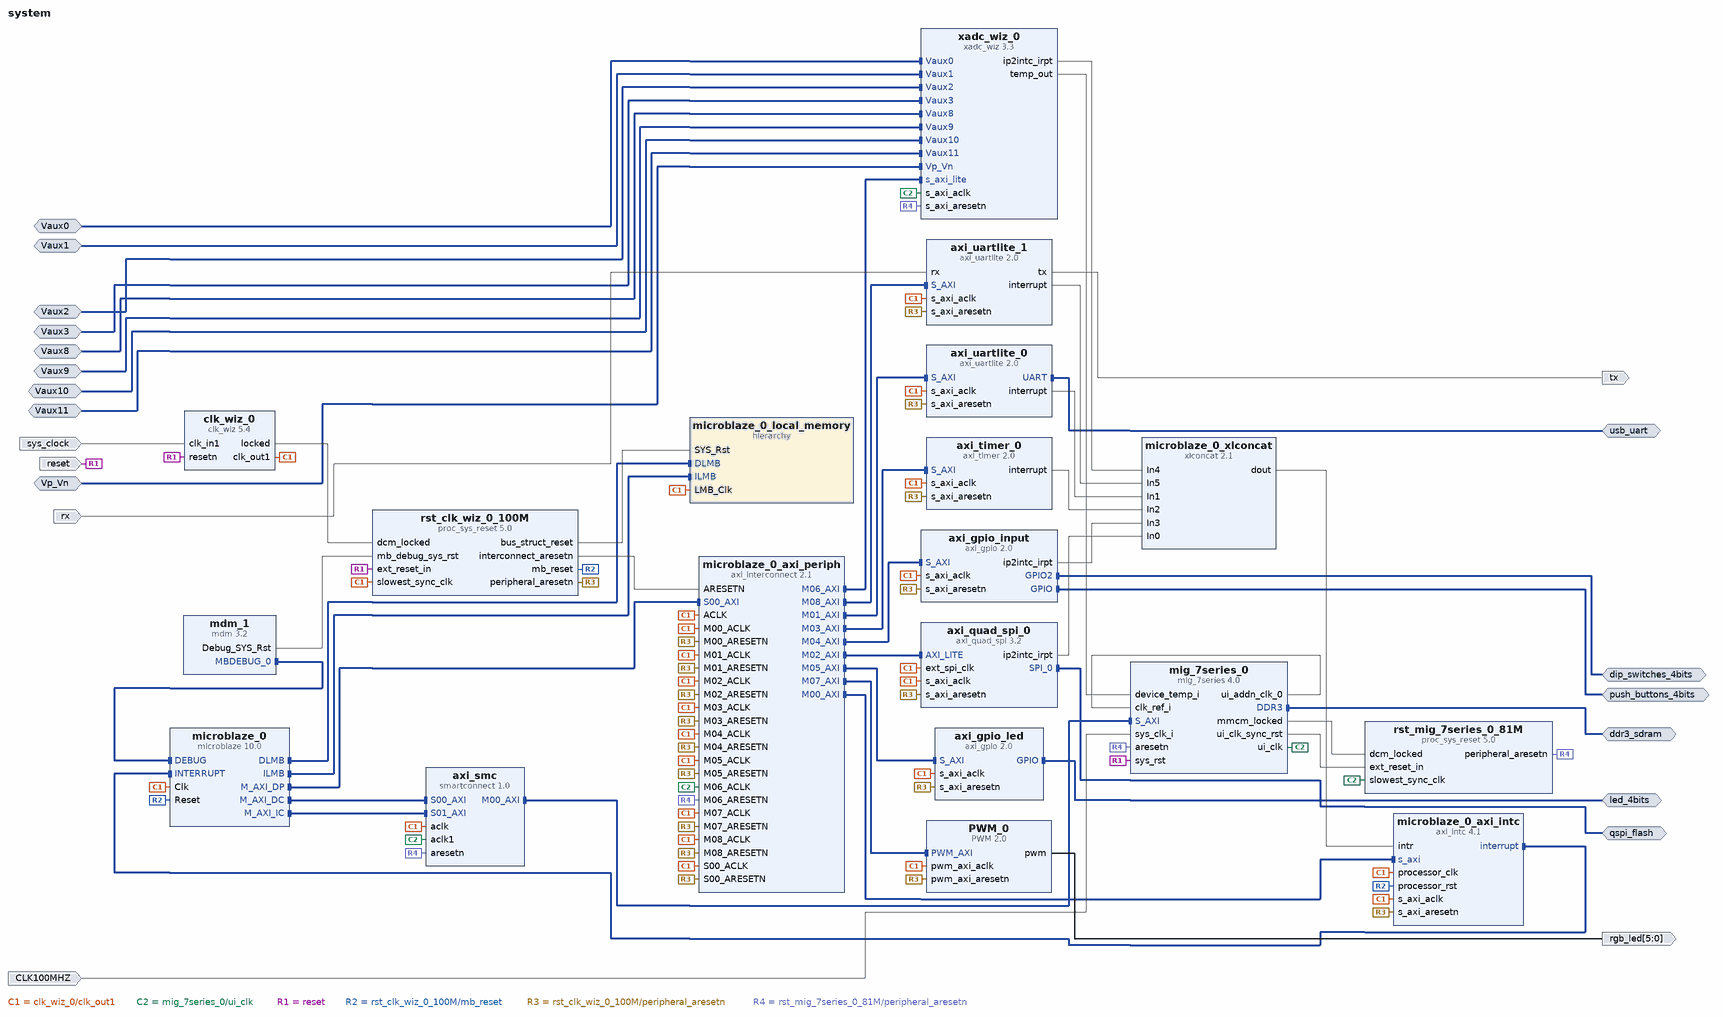
[diagram p0: block diagram of the top level]
# Vivado block design system, xc7s50csga324-1, Vivado 2017.4
create_bd_design system

create_bd_intf_port -mode Slave -vlnv xilinx.com:interface:diff_analog_io_rtl:1.0 Vaux0
create_bd_intf_port -mode Slave -vlnv xilinx.com:interface:diff_analog_io_rtl:1.0 Vaux1
create_bd_intf_port -mode Slave -vlnv xilinx.com:interface:diff_analog_io_rtl:1.0 Vaux2
create_bd_intf_port -mode Slave -vlnv xilinx.com:interface:diff_analog_io_rtl:1.0 Vaux3
create_bd_intf_port -mode Slave -vlnv xilinx.com:interface:diff_analog_io_rtl:1.0 Vaux8
create_bd_intf_port -mode Slave -vlnv xilinx.com:interface:diff_analog_io_rtl:1.0 Vaux9
create_bd_intf_port -mode Slave -vlnv xilinx.com:interface:diff_analog_io_rtl:1.0 Vaux10
create_bd_intf_port -mode Slave -vlnv xilinx.com:interface:diff_analog_io_rtl:1.0 Vaux11
create_bd_intf_port -mode Slave -vlnv xilinx.com:interface:diff_analog_io_rtl:1.0 Vp_Vn
create_bd_intf_port -mode Master -vlnv xilinx.com:interface:ddrx_rtl:1.0 ddr3_sdram
create_bd_intf_port -mode Master -vlnv xilinx.com:interface:gpio_rtl:1.0 dip_switches_4bits
create_bd_intf_port -mode Master -vlnv xilinx.com:interface:gpio_rtl:1.0 led_4bits
create_bd_intf_port -mode Master -vlnv xilinx.com:interface:gpio_rtl:1.0 push_buttons_4bits
create_bd_intf_port -mode Master -vlnv xilinx.com:interface:spi_rtl:1.0 qspi_flash
create_bd_intf_port -mode Master -vlnv xilinx.com:interface:uart_rtl:1.0 usb_uart
create_bd_port -dir O -from 5 -to 0 rgb_led
create_bd_port -dir I -type rst reset
set_property -dict {CONFIG.POLARITY ACTIVE_LOW} [get_bd_ports reset]
create_bd_port -dir I -type clk CLK100MHZ
create_bd_port -dir I -type clk sys_clock
set_property -dict {CONFIG.FREQ_HZ 12000000 CONFIG.PHASE 0.000} [get_bd_ports sys_clock]
create_bd_port -dir I rx
create_bd_port -dir O tx

create_bd_cell -type ip -vlnv digilentinc.com:IP:PWM:2.0 PWM_0
set_property -dict {CONFIG.NUM_PWM 6} [get_bd_cells PWM_0]
create_bd_cell -type hier microblaze_0_local_memory
create_bd_cell -type ip -vlnv xilinx.com:ip:axi_intc:4.1 microblaze_0_axi_intc
set_property -dict {CONFIG.C_HAS_FAST 1} [get_bd_cells microblaze_0_axi_intc]
create_bd_cell -type ip -vlnv xilinx.com:ip:xlconcat:2.1 microblaze_0_xlconcat
set_property -dict {CONFIG.NUM_PORTS 6 CONFIG.dout_width 6} [get_bd_cells microblaze_0_xlconcat]
create_bd_cell -type ip -vlnv xilinx.com:ip:mig_7series:4.0 mig_7series_0
set_property -dict {CONFIG.XML_INPUT_FILE board.prj CONFIG.BOARD_MIG_PARAM ddr3_sdram} [get_bd_cells mig_7series_0]
create_bd_cell -type ip -vlnv xilinx.com:ip:proc_sys_reset:5.0 rst_clk_wiz_0_100M
set_property -dict [list \
  CONFIG.C_EXT_RESET_HIGH 0 \
  CONFIG.USE_BOARD_FLOW true \
  CONFIG.RESET_BOARD_INTERFACE reset \
] [get_bd_cells rst_clk_wiz_0_100M]
create_bd_cell -type ip -vlnv xilinx.com:ip:proc_sys_reset:5.0 rst_mig_7series_0_81M
create_bd_cell -type ip -vlnv xilinx.com:ip:axi_gpio:2.0 axi_gpio_input
set_property -dict [list \
  CONFIG.C_INTERRUPT_PRESENT 1 \
  CONFIG.USE_BOARD_FLOW true \
  CONFIG.GPIO_BOARD_INTERFACE push_buttons_4bits \
  CONFIG.GPIO2_BOARD_INTERFACE dip_switches_4bits \
] [get_bd_cells axi_gpio_input]
create_bd_cell -type ip -vlnv xilinx.com:ip:axi_gpio:2.0 axi_gpio_led
set_property -dict [list \
  CONFIG.C_IS_DUAL 0 \
  CONFIG.USE_BOARD_FLOW true \
  CONFIG.GPIO_BOARD_INTERFACE led_4bits \
  CONFIG.GPIO2_BOARD_INTERFACE Custom \
] [get_bd_cells axi_gpio_led]
create_bd_cell -type ip -vlnv xilinx.com:ip:axi_quad_spi:3.2 axi_quad_spi_0
set_property -dict [list \
  CONFIG.C_SPI_MEMORY 3 \
  CONFIG.C_SPI_MODE 2 \
  CONFIG.C_FIFO_DEPTH 256 \
  CONFIG.USE_BOARD_FLOW true \
  CONFIG.QSPI_BOARD_INTERFACE qspi_flash \
  CONFIG.C_S_AXI4_ID_WIDTH 0 \
] [get_bd_cells axi_quad_spi_0]
create_bd_cell -type ip -vlnv xilinx.com:ip:smartconnect:1.0 axi_smc
set_property -dict {CONFIG.NUM_SI 2 CONFIG.NUM_CLKS 2} [get_bd_cells axi_smc]
create_bd_cell -type ip -vlnv xilinx.com:ip:axi_timer:2.0 axi_timer_0
create_bd_cell -type ip -vlnv xilinx.com:ip:axi_uartlite:2.0 axi_uartlite_0
set_property -dict [list \
  CONFIG.C_BAUDRATE 115200 \
  CONFIG.USE_BOARD_FLOW true \
  CONFIG.UARTLITE_BOARD_INTERFACE usb_uart \
] [get_bd_cells axi_uartlite_0]
create_bd_cell -type ip -vlnv xilinx.com:ip:clk_wiz:5.4 clk_wiz_0
set_property -dict [list \
  CONFIG.PRIMITIVE MMCM \
  CONFIG.CLKIN1_JITTER_PS 833.33 \
  CONFIG.CLKOUT1_DRIVES BUFG \
  CONFIG.CLKOUT2_DRIVES BUFG \
  CONFIG.CLKOUT3_DRIVES BUFG \
  CONFIG.CLKOUT4_DRIVES BUFG \
  CONFIG.CLKOUT5_DRIVES BUFG \
  CONFIG.CLKOUT6_DRIVES BUFG \
  CONFIG.CLKOUT7_DRIVES BUFG \
  CONFIG.FEEDBACK_SOURCE FDBK_AUTO \
  CONFIG.RESET_PORT resetn \
  CONFIG.MMCM_DIVCLK_DIVIDE 1 \
  CONFIG.MMCM_CLKFBOUT_MULT_F 62.500 \
  CONFIG.MMCM_CLKIN1_PERIOD 83.333 \
  CONFIG.MMCM_CLKIN2_PERIOD 10.0 \
  CONFIG.MMCM_COMPENSATION ZHOLD \
  CONFIG.MMCM_CLKOUT0_DIVIDE_F 7.500 \
  CONFIG.RESET_TYPE ACTIVE_LOW \
  CONFIG.USE_BOARD_FLOW true \
  CONFIG.CLK_IN1_BOARD_INTERFACE sys_clock \
  CONFIG.RESET_BOARD_INTERFACE reset \
  CONFIG.CLKOUT1_JITTER 479.872 \
  CONFIG.CLKOUT1_PHASE_ERROR 668.310 \
] [get_bd_cells clk_wiz_0]
create_bd_cell -type ip -vlnv xilinx.com:ip:mdm:3.2 mdm_1
create_bd_cell -type ip -vlnv xilinx.com:ip:microblaze:10.0 microblaze_0
set_property -dict [list \
  CONFIG.C_D_AXI 1 \
  CONFIG.C_D_LMB 1 \
  CONFIG.C_I_LMB 1 \
  CONFIG.G_TEMPLATE_LIST 9 \
  CONFIG.G_USE_EXCEPTIONS 1 \
  CONFIG.C_USE_MSR_INSTR 1 \
  CONFIG.C_USE_PCMP_INSTR 1 \
  CONFIG.C_USE_BARREL 1 \
  CONFIG.C_USE_DIV 1 \
  CONFIG.C_USE_HW_MUL 1 \
  CONFIG.C_USE_FPU 0 \
  CONFIG.C_UNALIGNED_EXCEPTIONS 1 \
  CONFIG.C_ILL_OPCODE_EXCEPTION 1 \
  CONFIG.C_M_AXI_I_BUS_EXCEPTION 1 \
  CONFIG.C_M_AXI_D_BUS_EXCEPTION 1 \
  CONFIG.C_DIV_ZERO_EXCEPTION 1 \
  CONFIG.C_USE_STACK_PROTECTION 1 \
  CONFIG.C_DEBUG_ENABLED 1 \
  CONFIG.C_NUMBER_OF_PC_BRK 2 \
  CONFIG.C_OPCODE_0x0_ILLEGAL 1 \
  CONFIG.C_USE_ICACHE 1 \
  CONFIG.C_ADDR_TAG_BITS 15 \
  CONFIG.C_CACHE_BYTE_SIZE 8192 \
  CONFIG.C_USE_DCACHE 1 \
  CONFIG.C_DCACHE_ADDR_TAG 15 \
  CONFIG.C_DCACHE_BYTE_SIZE 8192 \
  CONFIG.C_DCACHE_USE_WRITEBACK 1 \
  CONFIG.C_USE_BRANCH_TARGET_CACHE 0 \
] [get_bd_cells microblaze_0]
create_bd_cell -type ip -vlnv xilinx.com:ip:axi_interconnect:2.1 microblaze_0_axi_periph
set_property -dict {CONFIG.NUM_MI 9 CONFIG.SYNCHRONIZATION_STAGES 2} [get_bd_cells microblaze_0_axi_periph]
create_bd_cell -type ip -vlnv xilinx.com:ip:xadc_wiz:3.3 xadc_wiz_0
set_property -dict [list \
  CONFIG.INTERFACE_SELECTION Enable_AXI \
  CONFIG.XADC_STARUP_SELECTION channel_sequencer \
  CONFIG.ADC_CONVERSION_RATE 200 \
  CONFIG.SEQUENCER_MODE Continuous \
  CONFIG.ENABLE_RESET false \
  CONFIG.SINGLE_CHANNEL_SELECTION TEMPERATURE \
  CONFIG.EXTERNAL_MUX_CHANNEL VP_VN \
  CONFIG.CHANNEL_ENABLE_TEMPERATURE true \
  CONFIG.CHANNEL_ENABLE_VP_VN true \
  CONFIG.CHANNEL_ENABLE_VAUXP0_VAUXN0 true \
  CONFIG.CHANNEL_ENABLE_VAUXP1_VAUXN1 true \
  CONFIG.CHANNEL_ENABLE_VAUXP2_VAUXN2 true \
  CONFIG.CHANNEL_ENABLE_VAUXP3_VAUXN3 true \
  CONFIG.CHANNEL_ENABLE_VAUXP8_VAUXN8 true \
  CONFIG.CHANNEL_ENABLE_VAUXP9_VAUXN9 true \
  CONFIG.CHANNEL_ENABLE_VAUXP10_VAUXN10 true \
  CONFIG.CHANNEL_ENABLE_VAUXP11_VAUXN11 true \
  CONFIG.ENABLE_TEMP_BUS true \
] [get_bd_cells xadc_wiz_0]
create_bd_cell -type ip -vlnv xilinx.com:ip:axi_uartlite:2.0 axi_uartlite_1
set_property -dict {CONFIG.C_BAUDRATE 115200} [get_bd_cells axi_uartlite_1]

# ---- hierarchy /microblaze_0_local_memory ----
current_bd_instance /microblaze_0_local_memory
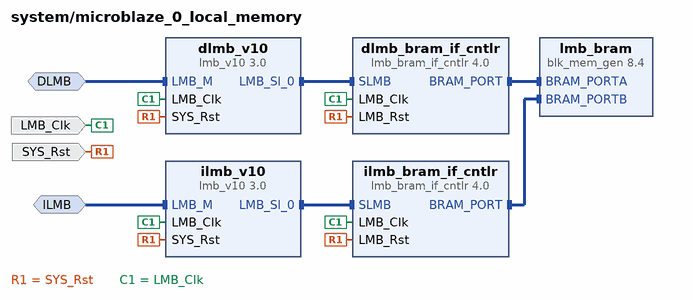
[diagram p1: block diagram inside /microblaze_0_local_memory]
create_bd_intf_pin -mode MirroredMaster -vlnv xilinx.com:interface:lmb_rtl:1.0 DLMB
create_bd_intf_pin -mode MirroredMaster -vlnv xilinx.com:interface:lmb_rtl:1.0 ILMB
create_bd_pin -dir I -type clk LMB_Clk
create_bd_pin -dir I -type rst SYS_Rst

create_bd_cell -type ip -vlnv xilinx.com:ip:lmb_v10:3.0 dlmb_v10
create_bd_cell -type ip -vlnv xilinx.com:ip:lmb_v10:3.0 ilmb_v10
create_bd_cell -type ip -vlnv xilinx.com:ip:lmb_bram_if_cntlr:4.0 dlmb_bram_if_cntlr
set_property -dict {CONFIG.C_ECC 0} [get_bd_cells dlmb_bram_if_cntlr]
create_bd_cell -type ip -vlnv xilinx.com:ip:lmb_bram_if_cntlr:4.0 ilmb_bram_if_cntlr
set_property -dict {CONFIG.C_ECC 0} [get_bd_cells ilmb_bram_if_cntlr]
create_bd_cell -type ip -vlnv xilinx.com:ip:blk_mem_gen:8.4 lmb_bram
set_property -dict [list \
  CONFIG.Memory_Type True_Dual_Port_RAM \
  CONFIG.Enable_B Use_ENB_Pin \
  CONFIG.Use_RSTB_Pin true \
  CONFIG.Port_B_Clock 100 \
  CONFIG.Port_B_Write_Rate 50 \
  CONFIG.Port_B_Enable_Rate 100 \
  CONFIG.use_bram_block BRAM_Controller \
  CONFIG.EN_SAFETY_CKT false \
] [get_bd_cells lmb_bram]

# ---- connections ----

current_bd_instance /microblaze_0_local_memory
connect_bd_intf_net -intf_net microblaze_0_dlmb_bus [get_bd_intf_pins dlmb_bram_if_cntlr/SLMB] [get_bd_intf_pins dlmb_v10/LMB_Sl_0]
connect_bd_intf_net -intf_net microblaze_0_dlmb_cntlr [get_bd_intf_pins dlmb_bram_if_cntlr/BRAM_PORT] [get_bd_intf_pins lmb_bram/BRAM_PORTA]
connect_bd_intf_net -intf_net microblaze_0_ilmb_bus [get_bd_intf_pins ilmb_bram_if_cntlr/SLMB] [get_bd_intf_pins ilmb_v10/LMB_Sl_0]
connect_bd_intf_net -intf_net microblaze_0_ilmb_cntlr [get_bd_intf_pins ilmb_bram_if_cntlr/BRAM_PORT] [get_bd_intf_pins lmb_bram/BRAM_PORTB]
connect_bd_intf_net -intf_net microblaze_0_dlmb [get_bd_intf_pins DLMB] [get_bd_intf_pins dlmb_v10/LMB_M]
connect_bd_intf_net -intf_net microblaze_0_ilmb [get_bd_intf_pins ILMB] [get_bd_intf_pins ilmb_v10/LMB_M]
connect_bd_net [get_bd_pins SYS_Rst] \
  [get_bd_pins dlmb_v10/SYS_Rst] [get_bd_pins ilmb_v10/SYS_Rst] [get_bd_pins dlmb_bram_if_cntlr/LMB_Rst] \
  [get_bd_pins ilmb_bram_if_cntlr/LMB_Rst]
connect_bd_net -net microblaze_0_Clk [get_bd_pins LMB_Clk] \
  [get_bd_pins dlmb_v10/LMB_Clk] [get_bd_pins ilmb_v10/LMB_Clk] [get_bd_pins dlmb_bram_if_cntlr/LMB_Clk] \
  [get_bd_pins ilmb_bram_if_cntlr/LMB_Clk]

current_bd_instance /
connect_bd_intf_net [get_bd_intf_pins axi_smc/M00_AXI] [get_bd_intf_pins mig_7series_0/S_AXI]
connect_bd_intf_net [get_bd_intf_pins axi_smc/S00_AXI] [get_bd_intf_pins microblaze_0/M_AXI_DC]
connect_bd_intf_net [get_bd_intf_pins axi_smc/S01_AXI] [get_bd_intf_pins microblaze_0/M_AXI_IC]
connect_bd_intf_net -intf_net microblaze_0_axi_dp [get_bd_intf_pins microblaze_0/M_AXI_DP] [get_bd_intf_pins microblaze_0_axi_periph/S00_AXI]
connect_bd_intf_net [get_bd_intf_pins axi_uartlite_0/S_AXI] [get_bd_intf_pins microblaze_0_axi_periph/M01_AXI]
connect_bd_intf_net [get_bd_intf_pins axi_quad_spi_0/AXI_LITE] [get_bd_intf_pins microblaze_0_axi_periph/M02_AXI]
connect_bd_intf_net [get_bd_intf_pins axi_timer_0/S_AXI] [get_bd_intf_pins microblaze_0_axi_periph/M03_AXI]
connect_bd_intf_net [get_bd_intf_pins axi_gpio_input/S_AXI] [get_bd_intf_pins microblaze_0_axi_periph/M04_AXI]
connect_bd_intf_net [get_bd_intf_pins axi_gpio_led/S_AXI] [get_bd_intf_pins microblaze_0_axi_periph/M05_AXI]
connect_bd_intf_net [get_bd_intf_pins microblaze_0_axi_periph/M06_AXI] [get_bd_intf_pins xadc_wiz_0/s_axi_lite]
connect_bd_intf_net [get_bd_intf_pins PWM_0/PWM_AXI] [get_bd_intf_pins microblaze_0_axi_periph/M07_AXI]
connect_bd_intf_net [get_bd_intf_pins mdm_1/MBDEBUG_0] [get_bd_intf_pins microblaze_0/DEBUG]
connect_bd_intf_net [get_bd_intf_pins microblaze_0/DLMB] [get_bd_intf_pins microblaze_0_local_memory/DLMB]
connect_bd_intf_net [get_bd_intf_pins microblaze_0/ILMB] [get_bd_intf_pins microblaze_0_local_memory/ILMB]
connect_bd_intf_net -intf_net microblaze_0_intc_axi [get_bd_intf_pins microblaze_0_axi_intc/s_axi] [get_bd_intf_pins microblaze_0_axi_periph/M00_AXI]
connect_bd_intf_net [get_bd_intf_pins microblaze_0/INTERRUPT] [get_bd_intf_pins microblaze_0_axi_intc/interrupt]
connect_bd_intf_net [get_bd_intf_pins microblaze_0_axi_periph/M08_AXI] [get_bd_intf_pins axi_uartlite_1/S_AXI]
connect_bd_intf_net -intf_net Vaux0_1 [get_bd_intf_ports Vaux0] [get_bd_intf_pins xadc_wiz_0/Vaux0]
connect_bd_intf_net -intf_net Vaux1_1 [get_bd_intf_ports Vaux1] [get_bd_intf_pins xadc_wiz_0/Vaux1]
connect_bd_intf_net -intf_net Vaux2_1 [get_bd_intf_ports Vaux2] [get_bd_intf_pins xadc_wiz_0/Vaux2]
connect_bd_intf_net -intf_net Vaux3_1 [get_bd_intf_ports Vaux3] [get_bd_intf_pins xadc_wiz_0/Vaux3]
connect_bd_intf_net -intf_net Vaux8_1 [get_bd_intf_ports Vaux8] [get_bd_intf_pins xadc_wiz_0/Vaux8]
connect_bd_intf_net -intf_net Vaux9_1 [get_bd_intf_ports Vaux9] [get_bd_intf_pins xadc_wiz_0/Vaux9]
connect_bd_intf_net -intf_net Vaux10_1 [get_bd_intf_ports Vaux10] [get_bd_intf_pins xadc_wiz_0/Vaux10]
connect_bd_intf_net -intf_net Vaux11_1 [get_bd_intf_ports Vaux11] [get_bd_intf_pins xadc_wiz_0/Vaux11]
connect_bd_intf_net [get_bd_intf_ports Vp_Vn] [get_bd_intf_pins xadc_wiz_0/Vp_Vn]
connect_bd_intf_net [get_bd_intf_ports ddr3_sdram] [get_bd_intf_pins mig_7series_0/DDR3]
connect_bd_intf_net -intf_net axi_gpio_0_GPIO2 [get_bd_intf_ports dip_switches_4bits] [get_bd_intf_pins axi_gpio_input/GPIO2]
connect_bd_intf_net -intf_net axi_gpio_0_GPIO1 [get_bd_intf_ports led_4bits] [get_bd_intf_pins axi_gpio_led/GPIO]
connect_bd_intf_net -intf_net axi_gpio_0_GPIO [get_bd_intf_ports push_buttons_4bits] [get_bd_intf_pins axi_gpio_input/GPIO]
connect_bd_intf_net [get_bd_intf_ports qspi_flash] [get_bd_intf_pins axi_quad_spi_0/SPI_0]
connect_bd_intf_net [get_bd_intf_ports usb_uart] [get_bd_intf_pins axi_uartlite_0/UART]
connect_bd_net [get_bd_pins PWM_0/pwm] [get_bd_ports rgb_led]
connect_bd_net -net axi_gpio_0_ip2intc_irpt [get_bd_pins axi_gpio_input/ip2intc_irpt] [get_bd_pins microblaze_0_xlconcat/In3]
connect_bd_net [get_bd_pins axi_quad_spi_0/ip2intc_irpt] [get_bd_pins microblaze_0_xlconcat/In0]
connect_bd_net [get_bd_pins axi_timer_0/interrupt] [get_bd_pins microblaze_0_xlconcat/In2]
connect_bd_net [get_bd_pins axi_uartlite_0/interrupt] [get_bd_pins microblaze_0_xlconcat/In1]
connect_bd_net [get_bd_pins clk_wiz_0/locked] [get_bd_pins rst_clk_wiz_0_100M/dcm_locked]
connect_bd_net [get_bd_pins mdm_1/Debug_SYS_Rst] [get_bd_pins rst_clk_wiz_0_100M/mb_debug_sys_rst]
connect_bd_net -net microblaze_0_Clk [get_bd_pins clk_wiz_0/clk_out1] \
  [get_bd_pins PWM_0/pwm_axi_aclk] [get_bd_pins microblaze_0_axi_intc/s_axi_aclk] \
  [get_bd_pins microblaze_0_axi_intc/processor_clk] [get_bd_pins rst_clk_wiz_0_100M/slowest_sync_clk] \
  [get_bd_pins axi_gpio_input/s_axi_aclk] [get_bd_pins axi_gpio_led/s_axi_aclk] [get_bd_pins axi_quad_spi_0/ext_spi_clk] \
  [get_bd_pins axi_quad_spi_0/s_axi_aclk] [get_bd_pins axi_smc/aclk] [get_bd_pins axi_timer_0/s_axi_aclk] \
  [get_bd_pins axi_uartlite_0/s_axi_aclk] [get_bd_pins microblaze_0/Clk] [get_bd_pins axi_uartlite_1/s_axi_aclk] \
  [get_bd_pins microblaze_0_local_memory/LMB_Clk] [get_bd_pins microblaze_0_axi_periph/ACLK] \
  [get_bd_pins microblaze_0_axi_periph/S00_ACLK] [get_bd_pins microblaze_0_axi_periph/M00_ACLK] \
  [get_bd_pins microblaze_0_axi_periph/M01_ACLK] [get_bd_pins microblaze_0_axi_periph/M02_ACLK] \
  [get_bd_pins microblaze_0_axi_periph/M03_ACLK] [get_bd_pins microblaze_0_axi_periph/M04_ACLK] \
  [get_bd_pins microblaze_0_axi_periph/M05_ACLK] [get_bd_pins microblaze_0_axi_periph/M07_ACLK] \
  [get_bd_pins microblaze_0_axi_periph/M08_ACLK]
connect_bd_net -net microblaze_0_intr [get_bd_pins microblaze_0_xlconcat/dout] [get_bd_pins microblaze_0_axi_intc/intr]
connect_bd_net [get_bd_pins mig_7series_0/mmcm_locked] [get_bd_pins rst_mig_7series_0_81M/dcm_locked]
connect_bd_net [get_bd_pins mig_7series_0/ui_addn_clk_0] [get_bd_pins mig_7series_0/clk_ref_i]
connect_bd_net [get_bd_pins mig_7series_0/ui_clk] \
  [get_bd_pins rst_mig_7series_0_81M/slowest_sync_clk] [get_bd_pins axi_smc/aclk1] [get_bd_pins xadc_wiz_0/s_axi_aclk] \
  [get_bd_pins microblaze_0_axi_periph/M06_ACLK]
connect_bd_net [get_bd_pins mig_7series_0/ui_clk_sync_rst] [get_bd_pins rst_mig_7series_0_81M/ext_reset_in]
connect_bd_net [get_bd_ports reset] [get_bd_pins mig_7series_0/sys_rst] [get_bd_pins rst_clk_wiz_0_100M/ext_reset_in] [get_bd_pins clk_wiz_0/resetn]
connect_bd_net [get_bd_pins rst_clk_wiz_0_100M/bus_struct_reset] [get_bd_pins microblaze_0_local_memory/SYS_Rst]
connect_bd_net [get_bd_pins rst_clk_wiz_0_100M/interconnect_aresetn] [get_bd_pins microblaze_0_axi_periph/ARESETN]
connect_bd_net [get_bd_pins rst_clk_wiz_0_100M/mb_reset] [get_bd_pins microblaze_0_axi_intc/processor_rst] [get_bd_pins microblaze_0/Reset]
connect_bd_net [get_bd_pins rst_clk_wiz_0_100M/peripheral_aresetn] \
  [get_bd_pins PWM_0/pwm_axi_aresetn] [get_bd_pins microblaze_0_axi_intc/s_axi_aresetn] \
  [get_bd_pins axi_gpio_input/s_axi_aresetn] [get_bd_pins axi_gpio_led/s_axi_aresetn] \
  [get_bd_pins axi_quad_spi_0/s_axi_aresetn] [get_bd_pins axi_timer_0/s_axi_aresetn] \
  [get_bd_pins axi_uartlite_0/s_axi_aresetn] [get_bd_pins axi_uartlite_1/s_axi_aresetn] \
  [get_bd_pins microblaze_0_axi_periph/S00_ARESETN] [get_bd_pins microblaze_0_axi_periph/M00_ARESETN] \
  [get_bd_pins microblaze_0_axi_periph/M01_ARESETN] [get_bd_pins microblaze_0_axi_periph/M02_ARESETN] \
  [get_bd_pins microblaze_0_axi_periph/M03_ARESETN] [get_bd_pins microblaze_0_axi_periph/M04_ARESETN] \
  [get_bd_pins microblaze_0_axi_periph/M05_ARESETN] [get_bd_pins microblaze_0_axi_periph/M07_ARESETN] \
  [get_bd_pins microblaze_0_axi_periph/M08_ARESETN]
connect_bd_net [get_bd_pins rst_mig_7series_0_81M/peripheral_aresetn] \
  [get_bd_pins mig_7series_0/aresetn] [get_bd_pins axi_smc/aresetn] [get_bd_pins xadc_wiz_0/s_axi_aresetn] \
  [get_bd_pins microblaze_0_axi_periph/M06_ARESETN]
connect_bd_net -net sys_clk_i_1 [get_bd_ports CLK100MHZ] [get_bd_pins mig_7series_0/sys_clk_i]
connect_bd_net [get_bd_ports sys_clock] [get_bd_pins clk_wiz_0/clk_in1]
connect_bd_net [get_bd_pins xadc_wiz_0/ip2intc_irpt] [get_bd_pins microblaze_0_xlconcat/In4]
connect_bd_net [get_bd_pins xadc_wiz_0/temp_out] [get_bd_pins mig_7series_0/device_temp_i]
connect_bd_net [get_bd_ports rx] [get_bd_pins axi_uartlite_1/rx]
connect_bd_net [get_bd_pins axi_uartlite_1/tx] [get_bd_ports tx]
connect_bd_net [get_bd_pins axi_uartlite_1/interrupt] [get_bd_pins microblaze_0_xlconcat/In5]

# ---- address map ----
assign_bd_address -offset 0x00000000 -range 64K -target_address_space [get_bd_addr_spaces microblaze_0/Data] [get_bd_addr_segs microblaze_0_local_memory/dlmb_bram_if_cntlr/SLMB/Mem]
assign_bd_address -offset 0x40000000 -range 64K -target_address_space [get_bd_addr_spaces microblaze_0/Data] [get_bd_addr_segs axi_gpio_input/S_AXI/Reg]
assign_bd_address -offset 0x40010000 -range 64K -target_address_space [get_bd_addr_spaces microblaze_0/Data] [get_bd_addr_segs axi_gpio_led/S_AXI/Reg]
assign_bd_address -offset 0x40600000 -range 64K -target_address_space [get_bd_addr_spaces microblaze_0/Data] [get_bd_addr_segs axi_uartlite_0/S_AXI/Reg]
assign_bd_address -offset 0x40610000 -range 64K -target_address_space [get_bd_addr_spaces microblaze_0/Data] [get_bd_addr_segs axi_uartlite_1/S_AXI/Reg]
assign_bd_address -offset 0x41200000 -range 64K -target_address_space [get_bd_addr_spaces microblaze_0/Data] [get_bd_addr_segs microblaze_0_axi_intc/S_AXI/Reg]
assign_bd_address -offset 0x41C00000 -range 64K -target_address_space [get_bd_addr_spaces microblaze_0/Data] [get_bd_addr_segs axi_timer_0/S_AXI/Reg]
assign_bd_address -offset 0x44A00000 -range 64K -target_address_space [get_bd_addr_spaces microblaze_0/Data] [get_bd_addr_segs axi_quad_spi_0/AXI_LITE/Reg]
assign_bd_address -offset 0x44A10000 -range 64K -target_address_space [get_bd_addr_spaces microblaze_0/Data] [get_bd_addr_segs xadc_wiz_0/s_axi_lite/Reg]
assign_bd_address -offset 0x44A20000 -range 64K -target_address_space [get_bd_addr_spaces microblaze_0/Data] [get_bd_addr_segs PWM_0/PWM_AXI/PWM_AXI_reg]
assign_bd_address -offset 0x80000000 -range 256M -target_address_space [get_bd_addr_spaces microblaze_0/Data] [get_bd_addr_segs mig_7series_0/memmap/memaddr]
assign_bd_address -offset 0x00000000 -range 64K -target_address_space [get_bd_addr_spaces microblaze_0/Instruction] [get_bd_addr_segs microblaze_0_local_memory/ilmb_bram_if_cntlr/SLMB/Mem]
assign_bd_address -offset 0x80000000 -range 256M -target_address_space [get_bd_addr_spaces microblaze_0/Instruction] [get_bd_addr_segs mig_7series_0/memmap/memaddr]

validate_bd_design
save_bd_design
